# EasyEDA Pro project Sensor_colis_examples.epro, board 2024-06-03_06-34-46
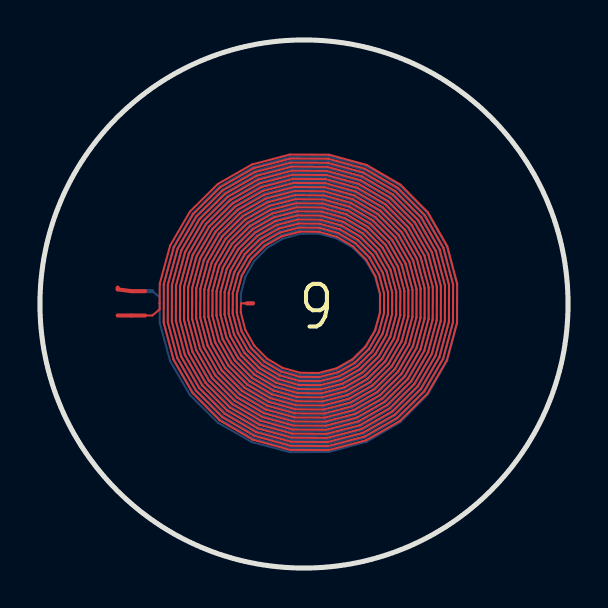
[diagram p16: board, top side]
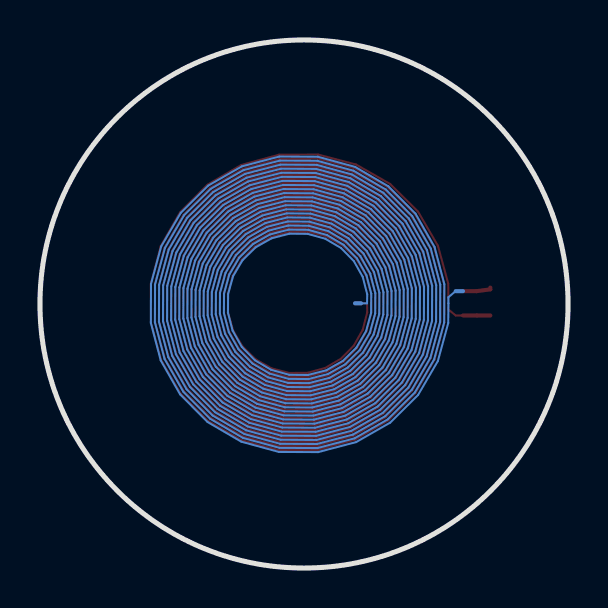
[diagram p17: board, bottom side, seen from below]

Outline 26.44 x 26.44 mm; copper layers: Top Layer, MidLayer1, MidLayer2, Bottom Layer. Coordinates in mm from the lower left corner of the outline.
Outline path: circle c13.22,13.22 r13.22
Stack: Top Layer 0.0356mm / SUBSTRATE1 0.32mm FR-4 er 4.8 / SUBSTRATE4 0.32mm FR-4 er 4.8 / SUBSTRATE5 0.32mm FR-4 er 4.8 / MidLayer1 0.0356mm / SUBSTRATE2 0.32mm FR-4 er 4.8 / MidLayer2 0.0356mm / SUBSTRATE3 0.32mm FR-4 er 4.8 / Bottom Layer 0.0356mm

## Design rules (mm)
spacing safeClearance (default): track to track 0.152, other pairs 0.152 to 0.3
track width trackWidth (default): min 0.127, default 0.254, max 2.54
differential pair differentialPair (default): width min 0.127, default 0.254, max 2.54; gap min 0.152, default 0.152
via viaSize (default): diameter min 0.5, default 0.61, max 10; hole min 0.3, default 0.305, max 6

## Placement (name value [footprint] x y rotation side)

## Nets

## Routing (per net, layer and track width the routed paths; a pad name or vN(x,y) marks a point on that pad's centre or on a via; arc(x,y) is an arc through that point)
3: length 1387.3
  Top Layer w0.102: 10.36,13.25 10.06,13.25 10.05,12.8 10.28,11.92 10.73,11.13 11.36,10.48 12.15,10.02 13.03,9.78 13.95,9.77 14.84,10 15.64,10.45 16.3,11.1 16.77,11.89 17.02,12.79 17.03,13.72 16.79,14.62 16.33,15.44 15.68,16.1 14.87,16.58 13.96,16.83 13.02,16.84 12.1,16.6 11.28,16.14 10.6,15.47 10.11,14.65 9.86,13.73 9.85,12.77 10.09,11.85 10.56,11.01 11.24,10.32 12.07,9.83 13.01,9.57 13.98,9.56 14.92,9.81 15.77,10.29 16.46,10.97 16.96,11.82 17.22,12.76 17.23,13.75 16.98,14.7 16.5,15.56 15.8,16.27 14.95,16.77 13.99,17.04 12.99,17.04 12.02,16.79 11.15,16.3 10.44,15.6 9.93,14.73 9.66,13.76 9.65,12.75 9.9,11.77 10.4,10.88 11.12,10.16 11.99,9.64 12.98,9.37 14,9.36 15,9.62 15.89,10.12 16.63,10.85 17.15,11.74 17.42,12.74 17.43,13.77 17.17,14.78 16.66,15.68 15.93,16.43 15.03,16.96 14.01,17.24 12.96,17.25 11.94,16.98 11.03,16.46 10.27,15.72 9.74,14.81 9.45,13.78 9.44,12.72 9.71,11.69 10.24,10.76 10.99,10 11.92,9.45 12.95,9.17 14.03,9.16 15.07,9.43 16.02,9.96 16.79,10.72 17.34,11.66 17.63,12.71 17.64,13.8 17.36,14.86 16.82,15.81 16.05,16.59 15.1,17.15 14.04,17.44 12.94,17.45 11.87,17.17 10.9,16.63 10.11,15.85 9.55,14.89 9.25,13.81 9.24,12.69 9.52,11.61 10.08,10.63 10.87,9.83 11.84,9.26 12.92,8.96 14.06,8.95 15.15,9.24 16.14,9.8 16.95,10.6 17.53,11.58 17.83,12.68 17.84,13.83 17.55,14.94 16.98,15.93 16.18,16.75 15.18,17.34 14.07,17.65 12.91,17.65 11.79,17.36 10.78,16.79 9.95,15.97 9.36,14.96 9.05,13.84 9.04,12.67 9.33,11.53 9.91,10.51 10.74,9.67 11.76,9.07 12.9,8.76 14.08,8.75 15.23,9.05 16.26,9.64 17.11,10.47 17.72,11.5 18.03,12.65 18.04,13.85 17.74,15.01 17.15,16.06 16.3,16.92 15.26,17.53 14.09,17.85 12.88,17.86 11.71,17.55 10.65,16.95 9.79,16.1 9.17,15.04 8.84,13.86 8.84,12.64 9.14,11.45 9.75,10.38 10.62,9.51 11.68,8.88 12.87,8.56 14.11,8.55 15.31,8.86 16.39,9.47 17.28,10.35 17.91,11.42 18.24,12.63 18.25,13.88 17.93,15.09 17.31,16.18 16.43,17.08 15.34,17.72 14.12,18.05 12.86,18.06 11.63,17.74 10.53,17.11 9.62,16.22 8.98,15.12 8.64,13.89 8.63,12.61 8.96,11.37 9.59,10.26 10.49,9.35 11.6,8.69 12.84,8.35 14.14,8.34 15.39,8.67 16.51,9.31 17.44,10.22 18.1,11.35 18.44,12.6 18.45,13.91 18.12,15.17 17.47,16.31 16.55,17.24 15.42,17.91 14.15,18.25 12.83,18.26 11.55,17.93 10.4,17.28 9.46,16.35 8.79,15.2 8.44,13.92 8.43,12.59 8.77,11.3 9.43,10.14 10.37,9.18 11.52,8.51 12.82,8.15 14.16,8.14 15.47,8.48 16.64,9.15 17.6,10.1 18.29,11.27 18.64,12.57 18.65,13.93 18.31,15.25 17.63,16.43 16.68,17.4 15.5,18.1 14.18,18.46 12.8,18.47 11.47,18.12 10.28,17.44 9.3,16.47 8.6,15.28 8.23,13.95 8.23,12.56 8.58,11.22 9.26,10.01 10.24,9.02 11.44,8.32 12.79,7.95 14.19,7.94 15.54,8.29 16.76,8.99 17.76,9.97 18.47,11.19 18.85,12.55 18.86,13.96 18.5,15.33 17.8,16.56 16.8,17.57 15.57,18.28 14.2,18.66 12.78,18.67 11.4,18.31 10.15,17.6 9.14,16.59 8.41,15.36 8.03,13.97 8.02,12.53 8.39,11.14 9.1,9.89 10.12,8.86 11.37,8.13 12.76,7.74 14.22,7.73 15.62,8.1 16.89,8.82 17.93,9.85 18.66,11.11 19.05,12.52 19.06,13.99 18.69,15.41 17.96,16.68 16.92,17.73 15.65,18.47 14.23,18.86 12.75,18.87 11.32,18.5 10.03,17.76 8.97,16.72 8.22,15.44 7.83,14 7.82,12.51 8.2,11.06 8.94,9.76 9.99,8.7 11.29,7.94 12.74,7.54 14.24,7.53 15.7,7.91 17.01,8.66 18.09,9.72 18.85,11.03 19.25,12.49 19.26,14.01 18.88,15.48 18.12,16.81 17.05,17.89 15.73,18.66 14.26,19.07 12.72,19.08 11.24,18.69 9.9,17.93 8.81,16.84 8.03,15.51 7.62,14.03 7.62,12.48 8.01,10.98 8.78,9.64 9.87,8.53 11.21,7.75 12.71,7.34 14.27,7.33 15.78,7.72 17.14,8.5 18.25,9.6 19.04,10.95 19.46,12.47 19.47,14.04 19.07,15.56 18.29,16.93 17.17,18.06 15.81,18.85 14.28,19.27 12.7,19.28 11.16,18.88 9.78,18.09 8.65,16.97 7.84,15.59 7.42,14.05 7.41,12.45 7.82,10.9 8.61,9.51 9.74,8.37 11.13,7.56 12.68,7.13 14.3,7.13 15.86,7.53 17.26,8.34 18.41,9.47 19.23,10.87 19.66,12.44 19.67,14.07 19.26,15.64 18.45,17.06 17.3,18.22 15.89,19.04 14.31,19.47 12.67,19.48 11.08,19.07 9.65,18.25 8.48,17.09 7.65,15.67 7.22,14.08 7.21,12.43 7.63,10.83 8.45,9.39 9.62,8.21 11.05,7.37 12.66,6.93 14.32,6.92 15.94,7.35 17.39,8.17 18.58,9.35 19.42,10.8 19.86,12.41 19.87,14.09 19.44,15.72 18.61,17.18 17.42,18.38 15.97,19.23 14.34,19.68 12.64,19.69 11,19.26 9.53,18.41 8.32,17.22 7.46,15.75 7.01,14.11 7.01,12.4 7.44,10.75 8.29,9.26 9.49,8.04 10.97,7.18 12.63,6.73 14.35,6.72 16.02,7.16 17.51,8.01 18.74,9.23 19.61,10.72 20.07,12.39 20.08,14.12 19.63,15.8 18.77,17.31 17.55,18.54 16.04,19.42 14.36,19.88 12.62,19.89 10.93,19.44 9.4,18.58 8.16,17.34 7.27,15.83 6.81,14.13 6.8,12.37 7.25,10.67 8.13,9.14 9.37,7.88 10.9,6.99 12.6,6.52 14.38,6.52 16.09,6.97 17.64,7.85 18.9,9.1 19.8,10.64 20.27,12.36 20.28,14.15 19.82,15.88 18.94,17.43 17.67,18.71 16.12,19.61 14.39,20.08 12.59,20.09 10.85,19.63 9.28,18.74 8,17.47 7.09,15.91 6.61,14.16 6.6,12.35 7.06,10.59 7.96,9.01 9.24,7.72 10.82,6.8 12.58,6.32 14.4,6.31 16.17,6.78 17.76,7.69 19.06,8.98 19.99,10.56 20.47,12.33 20.48,14.17 20.01,15.96 19.1,17.56 17.8,18.87 16.2,19.8 14.42,20.29 12.56,20.3 10.77,19.82 9.16,18.9 7.83,17.59 6.9,15.98 6.41,14.19 6.4,12.32 6.87,10.51 7.8,8.89 9.12,7.56 10.74,6.61 12.55,6.12 14.43,6.11 16.25,6.59 17.89,7.52 19.23,8.85 20.18,10.48 20.68,12.31 20.68,14.2 20.2,16.03 19.26,17.68 17.92,19.03 16.28,19.99 14.44,20.49 12.54,20.5 10.69,20.01 9.03,19.06 7.67,17.72 6.71,16.06 6.2,14.21 6.19,12.29 6.68,10.43 7.64,8.76 8.99,7.39 10.66,6.42 12.52,5.91 14.46,5.91 16.33,6.4 18.01,7.36 19.39,8.73 20.37,10.4 20.88,12.28 20.89,14.23 20.39,16.11 19.42,17.81 18.05,19.19 16.36,20.18 14.47,20.69 12.51,20.7 10.61,20.2 8.91,19.23 7.51,17.84 6.52,16.14 6,14.24 5.99,13.25 5.99,12.95 5.62,12.64 5.26,12.64
  Top Layer w0.203: 10.36,13.25 10.66,13.25 ; 5.26,13.86 4.58,13.86 3.89,13.95 3.89,14.04 ; 5.26,12.64 3.89,12.64
  Bottom Layer w0.102: 10.36,13.25 10.06,13.25 10.05,13.71 10.28,14.58 10.73,15.37 11.36,16.02 12.15,16.49 13.03,16.73 13.95,16.74 14.84,16.51 15.64,16.06 16.3,15.41 16.77,14.61 17.02,13.72 17.03,12.79 16.79,11.88 16.33,11.07 15.68,10.4 14.87,9.93 13.96,9.67 13.02,9.67 12.1,9.9 11.28,10.37 10.6,11.03 10.11,11.86 9.86,12.78 9.85,13.73 10.09,14.66 10.56,15.5 11.24,16.19 12.07,16.68 13.01,16.93 13.98,16.94 14.92,16.7 15.77,16.22 16.46,15.53 16.96,14.69 17.22,13.74 17.23,12.76 16.98,11.81 16.5,10.95 15.8,10.24 14.95,9.74 13.99,9.47 12.99,9.46 12.02,9.71 11.15,10.21 10.44,10.91 9.93,11.78 9.66,12.75 9.65,13.76 9.9,14.74 10.4,15.62 11.12,16.35 11.99,16.86 12.98,17.14 14,17.15 15,16.89 15.89,16.38 16.63,15.66 17.15,14.77 17.42,13.77 17.43,12.73 17.17,11.73 16.66,10.82 15.93,10.08 15.03,9.55 14.01,9.27 12.96,9.26 11.94,9.52 11.03,10.04 10.27,10.78 9.74,11.7 9.45,12.72 9.44,13.79 9.71,14.82 10.24,15.75 10.99,16.51 11.92,17.05 12.95,17.34 14.03,17.35 15.07,17.08 16.02,16.54 16.79,15.78 17.34,14.85 17.63,13.8 17.64,12.71 17.36,11.65 16.82,10.7 16.05,9.91 15.1,9.36 14.04,9.06 12.94,9.06 11.87,9.33 10.9,9.88 10.11,10.66 9.55,11.62 9.25,12.69 9.24,13.81 9.52,14.9 10.08,15.87 10.87,16.67 11.84,17.24 12.92,17.54 14.06,17.55 15.15,17.27 16.14,16.71 16.95,15.91 17.53,14.93 17.83,13.82 17.84,12.68 17.55,11.57 16.98,10.57 16.18,9.75 15.18,9.17 14.07,8.86 12.91,8.85 11.79,9.14 10.78,9.72 9.95,10.54 9.36,11.54 9.05,12.67 9.04,13.84 9.33,14.97 9.91,16 10.74,16.84 11.76,17.43 12.9,17.75 14.08,17.76 15.23,17.46 16.26,16.87 17.11,16.03 17.72,15 18.03,13.85 18.04,12.65 17.74,11.49 17.15,10.45 16.3,9.59 15.26,8.98 14.09,8.66 12.88,8.65 11.71,8.96 10.65,9.56 9.79,10.41 9.17,11.46 8.84,12.64 8.84,13.87 9.14,15.05 9.75,16.12 10.62,17 11.68,17.62 12.87,17.95 14.11,17.96 15.31,17.65 16.39,17.03 17.28,16.16 17.91,15.08 18.24,13.88 18.25,12.63 17.93,11.41 17.31,10.32 16.43,9.43 15.34,8.79 14.12,8.45 12.86,8.45 11.63,8.77 10.53,9.39 9.62,10.29 8.98,11.38 8.64,12.61 8.63,13.89 8.96,15.13 9.59,16.25 10.49,17.16 11.6,17.81 12.84,18.15 14.14,18.16 15.39,17.84 16.51,17.19 17.44,16.28 18.1,15.16 18.44,13.9 18.45,12.6 18.12,11.34 17.47,10.2 16.55,9.26 15.42,8.6 14.15,8.25 12.83,8.24 11.55,8.58 10.4,9.23 9.46,10.16 8.79,11.31 8.44,12.59 8.43,13.92 8.77,15.21 9.43,16.37 10.37,17.32 11.52,18 12.82,18.36 14.16,18.37 15.47,18.02 16.64,17.36 17.6,16.41 18.29,15.24 18.64,13.93 18.65,12.57 18.31,11.26 17.63,10.07 16.68,9.1 15.5,8.41 14.18,8.05 12.8,8.04 11.47,8.39 10.28,9.07 9.3,10.04 8.6,11.23 8.23,12.56 8.23,13.95 8.58,15.29 9.26,16.5 10.24,17.49 11.44,18.19 12.79,18.56 14.19,18.57 15.54,18.21 16.76,17.52 17.76,16.53 18.47,15.32 18.85,13.96 18.86,12.55 18.5,11.18 17.8,9.95 16.8,8.94 15.57,8.22 14.2,7.84 12.78,7.84 11.4,8.2 10.15,8.91 9.14,9.91 8.41,11.15 8.03,12.53 8.02,13.97 8.39,15.37 9.1,16.62 10.12,17.65 11.37,18.38 12.76,18.76 14.22,18.77 15.62,18.4 16.89,17.68 17.93,16.66 18.66,15.4 19.05,13.99 19.06,12.52 18.69,11.1 17.96,9.82 16.92,8.78 15.65,8.03 14.23,7.64 12.75,7.63 11.32,8.01 10.03,8.74 8.97,9.79 8.22,11.07 7.83,12.51 7.82,14 8.2,15.45 8.94,16.75 9.99,17.81 11.29,18.57 12.74,18.97 14.24,18.97 15.7,18.59 17.01,17.85 18.09,16.78 18.85,15.47 19.25,14.01 19.26,12.49 18.88,11.02 18.12,9.7 17.05,8.61 15.73,7.84 14.26,7.44 12.72,7.43 11.24,7.82 9.9,8.58 8.81,9.66 8.03,10.99 7.62,12.48 7.62,14.03 8.01,15.52 8.78,16.87 9.87,17.97 11.21,18.76 12.71,19.17 14.27,19.18 15.78,18.78 17.14,18.01 18.25,16.91 19.04,15.55 19.46,14.04 19.47,12.47 19.07,10.94 18.29,9.57 17.17,8.45 15.81,7.65 14.28,7.24 12.7,7.23 11.16,7.63 9.78,8.42 8.65,9.54 7.84,10.91 7.42,12.45 7.41,14.05 7.82,15.6 8.61,16.99 9.74,18.14 11.13,18.95 12.68,19.37 14.3,19.38 15.86,18.97 17.26,18.17 18.41,17.03 19.23,15.63 19.66,14.07 19.67,12.44 19.26,10.86 18.45,9.45 17.3,8.29 15.89,7.46 14.31,7.03 12.67,7.02 11.08,7.44 9.65,8.25 8.48,9.41 7.65,10.84 7.22,12.43 7.21,14.08 7.63,15.68 8.45,17.12 9.62,18.3 11.05,19.14 12.66,19.58 14.32,19.58 15.94,19.16 17.39,18.33 18.58,17.16 19.42,15.71 19.86,14.09 19.87,12.41 19.44,10.79 18.61,9.32 17.42,8.13 15.97,7.27 14.34,6.83 12.64,6.82 11,7.25 9.53,8.09 8.32,9.29 7.46,10.76 7.01,12.4 7.01,14.11 7.44,15.76 8.29,17.24 9.49,18.46 10.97,19.33 12.63,19.78 14.35,19.79 16.02,19.35 17.51,18.5 18.74,17.28 19.61,15.79 20.07,14.12 20.08,12.39 19.63,10.71 18.77,9.2 17.55,7.96 16.04,7.09 14.36,6.63 12.62,6.62 10.93,7.06 9.4,7.93 8.16,9.16 7.27,10.68 6.81,12.37 6.8,14.13 7.25,15.84 8.13,17.37 9.37,18.62 10.9,19.52 12.6,19.98 14.38,19.99 16.09,19.54 17.64,18.66 18.9,17.41 19.8,15.87 20.27,14.15 20.28,12.36 19.82,10.63 18.94,9.07 17.67,7.8 16.12,6.9 14.39,6.42 12.59,6.41 10.85,6.87 9.28,7.77 8,9.04 7.09,10.6 6.61,12.35 6.6,14.16 7.06,15.92 7.96,17.49 9.24,18.79 10.82,19.71 12.58,20.19 14.4,20.19 16.17,19.73 17.76,18.82 19.06,17.53 19.99,15.95 20.47,14.17 20.48,12.33 20.01,10.55 19.1,8.95 17.8,7.64 16.2,6.71 14.42,6.22 12.56,6.21 10.77,6.68 9.16,7.6 7.83,8.91 6.9,10.52 6.41,12.32 6.4,14.19 6.87,15.99 7.8,17.62 9.12,18.95 10.74,19.89 12.55,20.39 14.43,20.4 16.25,19.92 17.89,18.98 19.23,17.66 20.18,16.02 20.68,14.2 20.68,12.31 20.2,10.47 19.26,8.83 17.92,7.48 16.28,6.52 14.44,6.02 12.54,6.01 10.69,6.49 9.03,7.44 7.67,8.79 6.71,10.44 6.2,12.29 6.19,14.21 6.68,16.07 7.64,17.74 8.99,19.11 10.66,20.08 12.52,20.59 14.46,20.6 16.33,20.11 18.01,19.15 19.39,17.78 20.37,16.1 20.88,14.23 20.89,12.28 20.39,10.39 19.42,8.7 18.05,7.31 16.36,6.33 14.47,5.81 12.51,5.8 10.61,6.3 8.91,7.28 7.51,8.66 6.52,10.36 6,12.27 5.99,13.25 5.99,13.56 5.62,13.86
  Bottom Layer w0.203: 10.36,13.25 10.66,13.25 ; 5.62,13.86 5.26,13.86

## Text on the board
Top Silkscreen Layer: Layers = 2 | Turns = 20 | Version - 1.1 | -------------- | Design Id - 111 | Coil Parameters | Customized for LDC1612 | Trace Width = 4.0 mils | Layer Stack Information | Trace Spacing = 4.0 mils | ------------------------- | WEBENCH Design Information | Copper thickness = 1.0 Oz-Cu | Exported on - 2024/06/03 06:34:44 | Inner Diameter = 271 mils (Approx.) | Outer Diameter = 591 mils (Approx.) | Space between TOP and BOTTOM = 4.0 mils | Exported from WEBENCH Coil Designer Tool | 9
